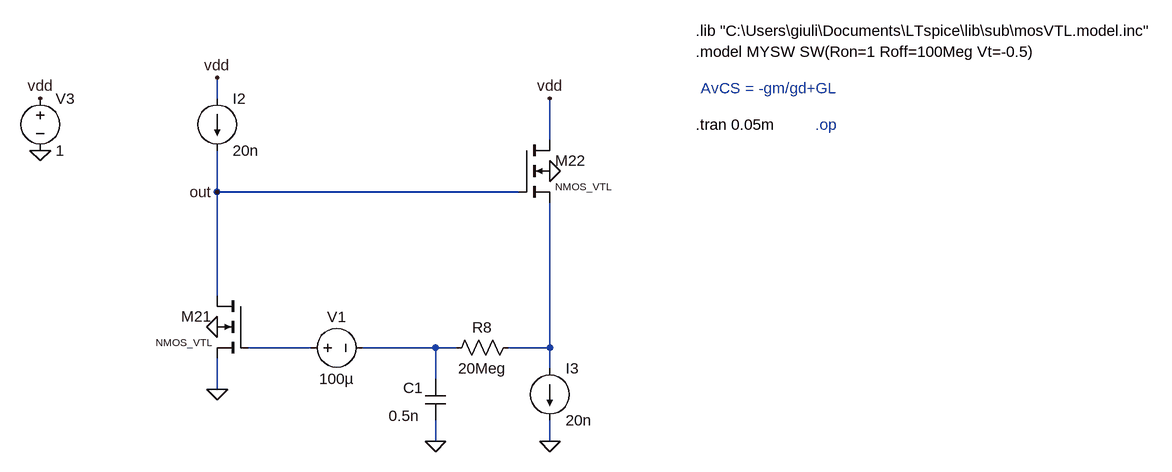
[diagram p0: schematic AMP - 2.asc]
AMP - 2.asc, the LTspice schematic file:
Version 4
SHEET 1 2012 680
WIRE -2000 -256 -2000 -288
WIRE -1488 -192 -1488 -256
WIRE -2000 -112 -2000 -176
WIRE -1536 -112 -2000 -112
WIRE -2000 48 -2000 -112
WIRE -1856 128 -1952 128
WIRE -1664 128 -1776 128
WIRE -1632 128 -1664 128
WIRE -1488 128 -1488 -96
WIRE -1488 128 -1552 128
WIRE -1488 160 -1488 128
WIRE -1664 176 -1664 128
WIRE -2000 192 -2000 144
WIRE -1664 272 -1664 240
WIRE -1488 272 -1488 240
FLAG -2000 192 0
FLAG -2000 96 0
FLAG -1488 -256 vdd
FLAG -2272 -176 0
FLAG -2272 -256 vdd
FLAG -1488 272 0
FLAG -1664 272 0
FLAG -1488 -144 0
FLAG -2000 -112 out
FLAG -2000 -288 vdd
SYMBOL nmos4 -1952 48 M0
WINDOW 3 56 72 Left 1
SYMATTR Value NMOS_VTL
SYMATTR InstName M21
SYMATTR Value2 l=50n w=75n
SYMBOL current -2000 -256 R0
WINDOW 123 0 0 Left 0
WINDOW 39 0 0 Left 0
SYMATTR InstName I2
SYMATTR Value 20n
SYMBOL nmos4 -1536 -192 R0
WINDOW 3 56 72 Left 1
SYMATTR Value NMOS_VTL
SYMATTR InstName M22
SYMATTR Value2 l=150n w=300n
SYMBOL voltage -2272 -272 R0
SYMATTR InstName V3
SYMATTR Value 1
SYMBOL current -1488 160 R0
WINDOW 123 0 0 Left 0
WINDOW 39 0 0 Left 0
SYMATTR InstName I3
SYMATTR Value 20n
SYMBOL res -1536 112 R90
WINDOW 0 0 56 VBottom 2
WINDOW 3 32 56 VTop 2
SYMATTR InstName R8
SYMATTR Value 20Meg
SYMBOL cap -1680 176 R0
WINDOW 0 -34 14 Left 2
WINDOW 3 -56 57 Left 2
SYMATTR InstName C1
SYMATTR Value 0.5n
SYMBOL voltage -1872 128 R270
WINDOW 0 32 56 VTop 2
WINDOW 3 -32 56 VBottom 2
SYMATTR InstName V1
SYMATTR Value 100µ
TEXT -1264 -360 Left 2 !.lib "C:\\Users\\giuli\\Documents\\LTspice\\lib\\sub\\mosVTL.model.inc"
TEXT -1264 -328 Left 2 !.model MYSW SW(Ron=1 Roff=100Meg Vt=-0.5)
TEXT -1264 -216 Left 2 !.tran 0.05m
TEXT -1080 -216 Left 2 ;.op
TEXT -1256 -272 Left 2 ;AvCS = -gm/gd+GL

The netlist it stands for:
* AMP - 2.asc
M21 out N001 0 0 NMOS_VTL l=50n w=75n
I2 vdd out 20n
M22 vdd out N003 0 NMOS_VTL l=150n w=300n
V3 vdd 0 1
I3 N003 0 20n
R8 N003 N002 20Meg
C1 N002 0 0.5n
V1 N001 N002 100µ
.model NMOS NMOS
.model PMOS PMOS
.lib standard.mos
.lib "C:\Users\giuli\Documents\LTspice\lib\sub\mosVTL.model.inc"
.model MYSW SW(Ron=1 Roff=100Meg Vt=-0.5)
.tran 0.05m
* .op
* AvCS = -gm/gd+GL
.backanno
.end